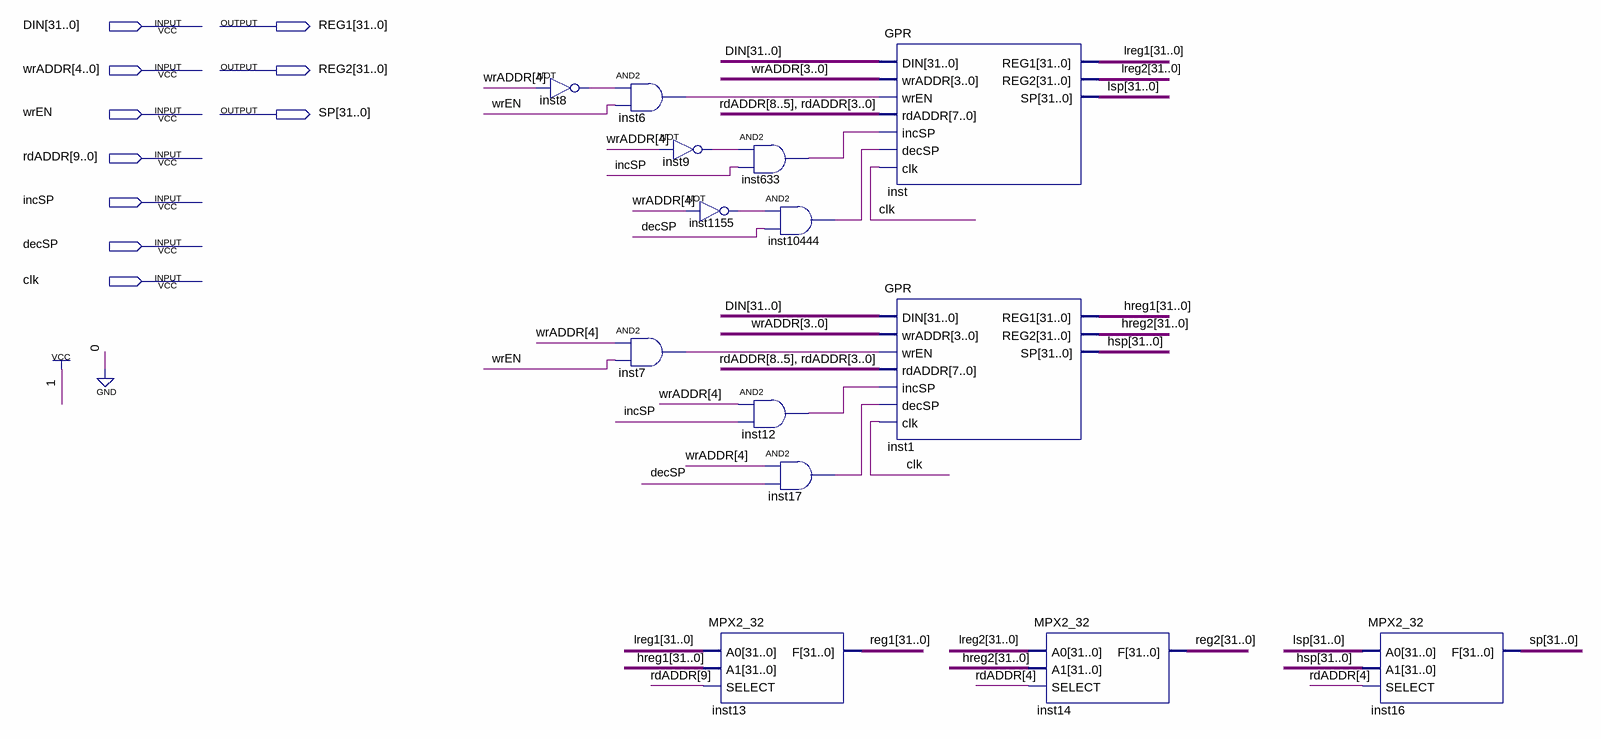
[diagram p0: schematic sheet]
// Quartus schematic GPR32x32.bdf as structural Verilog: 14 symbols, 10 pins
module GPR32x32 (
  input  [31:0] DIN,
  input  [4:0] wrADDR,
  input  wrEN,
  input  [9:0] rdADDR,
  input  incSP,
  input  decSP,
  input  clk,
  output [31:0] REG1,
  output [31:0] REG2,
  output [31:0] SP
);

  wire inst6_out, inst7_out, inst8_out, inst9_out, inst12_out, inst17_out, inst633_out, inst1155_out,
       inst10444_out;
  wire [31:0] hreg1, hreg2, hsp, lreg1, lreg2, lsp;

  not inst8 (inst8_out, wrADDR[4]);
  and inst6 (inst6_out, inst8_out, wrEN);
  and inst7 (inst7_out, wrADDR[4], wrEN);
  not inst9 (inst9_out, wrADDR[4]);
  not inst1155 (inst1155_out, wrADDR[4]);
  MPX2_32 inst13 (.A0(lreg1), .A1(hreg1), .SELECT(rdADDR[9]), .F(REG1));
  and inst633 (inst633_out, inst9_out, incSP);
  and inst10444 (inst10444_out, inst1155_out, decSP);
  and inst12 (inst12_out, wrADDR[4], incSP);
  and inst17 (inst17_out, wrADDR[4], decSP);
  GPR inst (
    .DIN(DIN), .wrADDR(wrADDR[3:0]), .wrEN(inst6_out), .rdADDR({rdADDR[8:5], rdADDR[3:0]}),
    .incSP(inst633_out), .decSP(inst10444_out), .clk(clk), .REG1(lreg1), .REG2(lreg2), .SP(lsp));
  GPR inst1 (
    .DIN(DIN), .wrADDR(wrADDR[3:0]), .wrEN(inst7_out), .rdADDR({rdADDR[8:5], rdADDR[3:0]}),
    .incSP(inst12_out), .decSP(inst17_out), .clk(clk), .REG1(hreg1), .REG2(hreg2), .SP(hsp));
  MPX2_32 inst14 (.A0(lreg2), .A1(hreg2), .SELECT(rdADDR[4]), .F(REG2));
  MPX2_32 inst16 (.A0(lsp), .A1(hsp), .SELECT(rdADDR[4]), .F(SP));
endmodule
